# EAGLE design Balancing V3 (EAGLE 9.6.2)
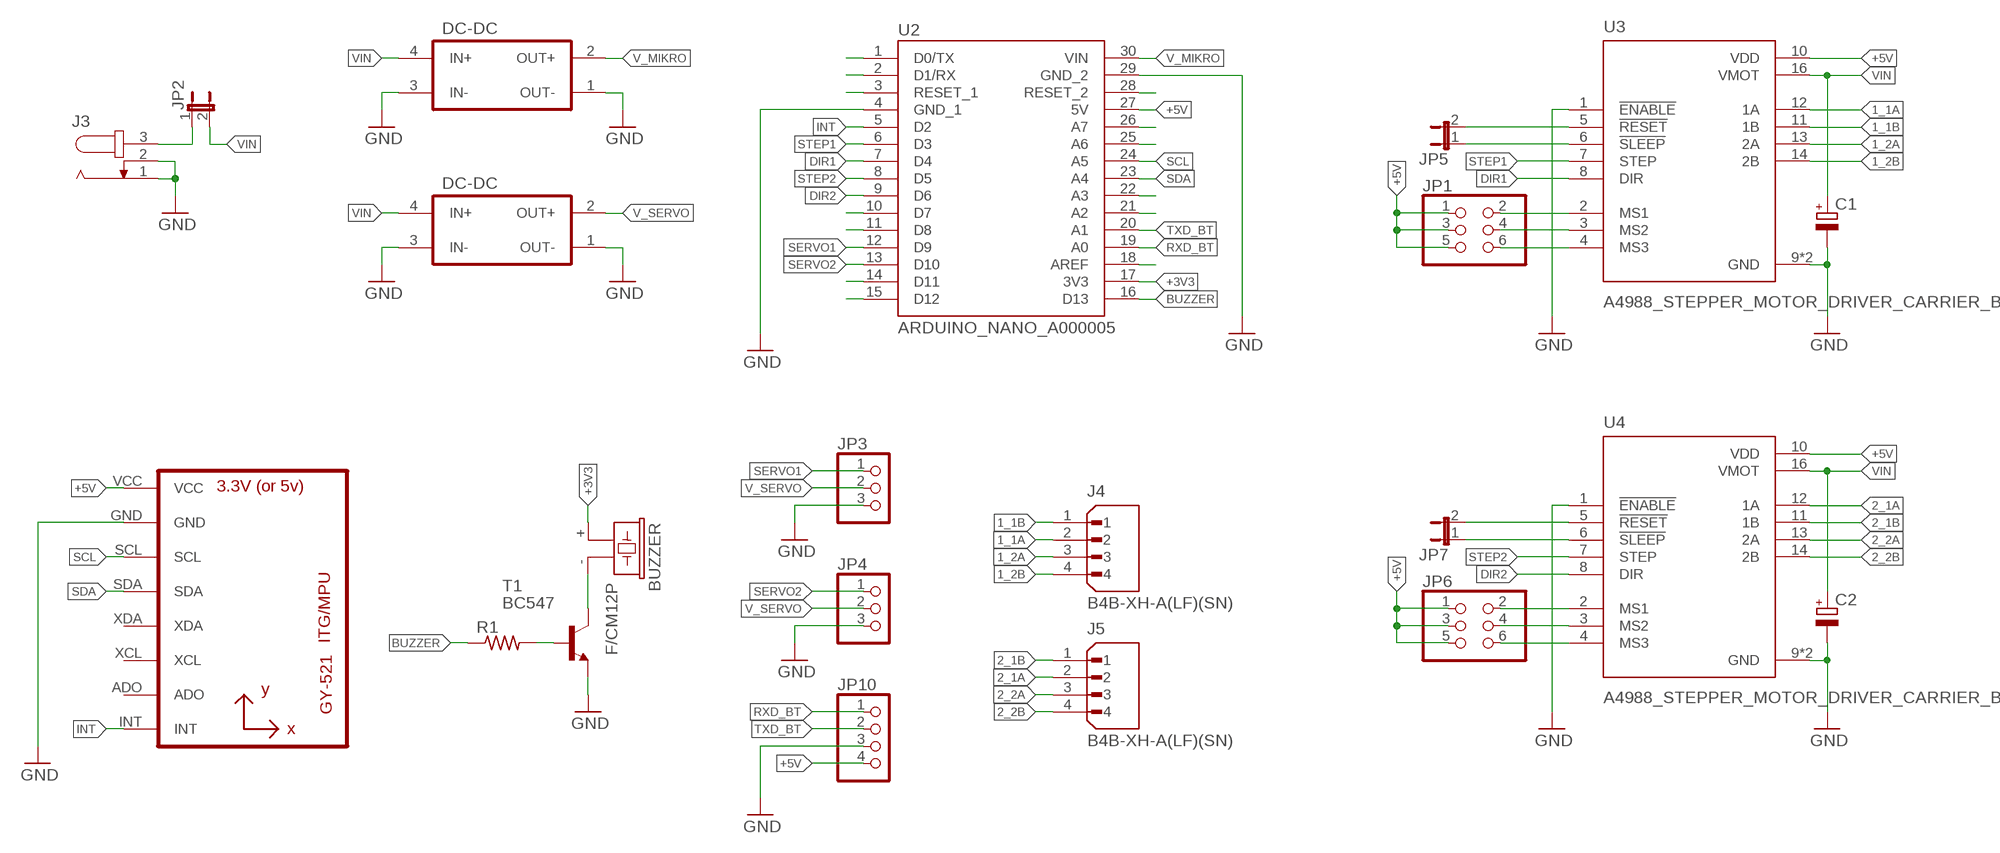
[diagram p0: schematic, sheet 1]

## Parts
BUZZER  F/CM12P  [F/CM12P]
C1  CPOL-EUE2.5-6  [E2,5-6]
C2  CPOL-EUE2.5-6  [E2,5-6]
J3  JACK-PLUG1  [SPC4078]
J4  B4B-XH-A(LF)(SN)  [JST_B4B-XH-A(LF)(SN)]
J5  B4B-XH-A(LF)(SN)  [JST_B4B-XH-A(LF)(SN)]
JP1  PINHD-2X3  [2X03]
JP2  JP1E  [JP1]
JP3  PINHD-1X3  [1X03]
JP4  PINHD-1X3  [1X03]
JP5  JP1E  [JP1]
JP6  PINHD-2X3  [2X03]
JP7  JP1E  [JP1]
JP10  PINHD-1X4  [1X04]
R1  R-US_0204/7  [0204/7]
T1  BC547  [TO92]
U1  GY-521MPU6050  [GY-521]
U2  ARDUINO_NANO_A000005  [MODULE_ARDUINO_NANO_A000005]
U3  A4988_STEPPER_MOTOR_DRIVER_CARRIER_BLACK  [MODULE_A4988_STEPPER_MOTOR_DRIVER_CARRIER_BLACK]
U4  A4988_STEPPER_MOTOR_DRIVER_CARRIER_BLACK  [MODULE_A4988_STEPPER_MOTOR_DRIVER_CARRIER_BLACK]
U$1  DC-DC_CONV  [DC-DC_CONV]
U$2  DC-DC_CONV  [DC-DC_CONV]

## Nets
1_1A: J4.2 U3.12(1A)
1_1B: J4.1 U3.11(1B)
1_2A: J4.3 U3.13(2A)
1_2B: J4.4 U3.14(2B)
2_1A: J5.2 U4.12(1A)
2_1B: J5.1 U4.11(1B)
2_2A: J5.3 U4.13(2A)
2_2B: J5.4 U4.14(2B)
+3V3: BUZZER.+ U2.17(3V3)
+5V: JP1.1 JP1.3 JP1.5 JP6.1 JP6.3 JP6.5 JP10.4 U1.VCC U2.27(5V) U3.10(VDD) U4.10(VDD)
BUZZER: R1.1 U2.16(D13)
DIR1: U2.7(D4) U3.8(DIR)
DIR2: U2.9(D6) U4.8(DIR)
GND: C1.- C2.- J3.1 J3.2 JP3.3 JP4.3 JP10.3 T1.1(E) U1.GND U2.4(GND_1) U2.29(GND_2) U3.1(!ENABLE) U3.9(GND) U3.15(GND) U4.1(!ENABLE) U4.9(GND) U4.15(GND) U$1.1(OUT-) U$1.3(IN-) U$2.1(OUT-) U$2.3(IN-)
INT: U1.INT U2.5(D2)
N$1: R1.2 T1.2(B)
N$2: BUZZER.- T1.3(C)
N$11: U2.28(RESET_2)
N$13: U2.26(A7)
N$14: U2.25(A6)
N$17: U2.22(A3)
N$18: U2.21(A2)
N$21: U2.18(AREF)
N$24: U2.1(D0/TX)
N$25: U2.2(D1/RX)
N$26: U2.3(RESET_1)
N$33: U2.10(D7)
N$34: U2.11(D8)
N$37: U2.14(D11)
N$38: U2.15(D12)
N$39: JP1.2 U3.2(MS1)
N$40: J3.3 JP2.1
N$41: JP1.4 U3.3(MS2)
N$42: JP1.6 U3.4(MS3)
N$43: JP7.2 U4.5(!RESET)
N$44: JP7.1 U4.6(!SLEEP)
N$45: JP6.2 U4.2(MS1)
N$46: JP6.4 U4.3(MS2)
N$47: JP6.6 U4.4(MS3)
N$60: JP5.2 U3.5(!RESET)
N$61: JP5.1 U3.6(!SLEEP)
RXD_BT: JP10.1 U2.19(A0)
SCL: U1.SCL U2.24(A5)
SDA: U1.SDA U2.23(A4)
SERVO1: JP3.1 U2.12(D9)
SERVO2: JP4.1 U2.13(D10)
STEP1: U2.6(D3) U3.7(STEP)
STEP2: U2.8(D5) U4.7(STEP)
TXD_BT: JP10.2 U2.20(A1)
V_MIKRO: U2.30(VIN) U$1.2(OUT+)
V_SERVO: JP3.2 JP4.2 U$2.2(OUT+)
VIN: C1.+ C2.+ JP2.2 U3.16(VMOT) U4.16(VMOT) U$1.4(IN+) U$2.4(IN+)
Unconnected: U1.ADO U1.XCL U1.XDA

## Library data of the parts
BUZZER = buzzer:F/CM12P: BUZZER Source: Buerklin; OC_FARNELL: unknown; OC_NEWARK: unknown
C1 C2 = rcl:CPOL-EU: POLARIZED CAPACITOR, European symbol; SPICEPREFIX: C
J3 = con-jack:JACK-PLUG: DC POWER JACK Power Jack, DC, Right Angle, Through Hole, Rated 5A at 16VDC, PC Terminals Distributor: Farnell (www.Farnell.de) Drawing: 84N1161.pdf / 84N1162.pdf Manufacturer: SPC Technology (www.spctechnology.com) Type: SPC4077 / SPC 4078; OC_FARNELL: unknown; OC_NEWARK: unknown
J4 J5 = JST_4P:B4B-XH-A(LF)(SN): Check availability <https://pricing.snapeda.com/parts/B4B-XH-A%20%20%28LF%29%28SN%29/JST/view-part?ref=eda>; AVAILABILITY: In Stock; CHECK_PRICES: https://www.snapeda.com/parts/B4B-XH-A%20%20(LF)(SN)/JST/view-part/?ref=eda; DESCRIPTION: HEADER, VERTICAL, 4WAY; Pitch Spacing: 2.5mm; No. of Contacts: 4Contacts; Gender: Header; Product Range: XH Series; Contact Termination Type: Through Hole; No. of Rows: 1Rows; Contact Plating: Tin Plated Contacts; Contact Material: Brass; SVHC: No SVHC (17-Dec-2015); Contact Resistance: 10mohm; Current Rating: 3A; Insulation Resistance: 1000Mohm; Operating Temperature Max: 85°C; Operating Temperature Min: -25°C; Voltage Rating VAC: 250V; Wire Size AWG Max: 22AWG; Wire Size AWG Min: 30AWG; Withstand Voltage: 1000V; MF: JST; MP: B4B-XH-A (LF)(SN); PACKAGE: None; PRICE: None; SNAPEDA_LINK: https://www.snapeda.com/parts/B4B-XH-A%20%20(LF)(SN)/JST/view-part/?ref=snap
JP1 JP6 = pinhead:PINHD-2X3: PIN HEADER
JP2 JP5 JP7 = jumper:JP1E: JUMPER
JP3 JP4 = pinhead:PINHD-1X3: PIN HEADER
JP10 = pinhead:PINHD-1X4: PIN HEADER
R1 = rcl:R-US_: RESISTOR, American symbol; SPICEPREFIX: R
T1 = transistor:BC547: NPN TRANSISTOR
U1 = gy-521:GY-521
U2 = ARDUINO_NANO_A000005:ARDUINO_NANO_A000005: Check availability <https://pricing.snapeda.com/parts/ARDUINO%20NANO%20A000005/Arduino/view-part?ref=eda>; AVAILABILITY: Not in stock; CHECK_PRICES: https://www.snapeda.com/parts/ARDUINO%20NANO%20A000005/Arduino/view-part/?ref=eda; DESCRIPTION: ATSAMD21G18A Arduino Nano 33 IoT series ARM® Cortex®-M0+ MCU 32-Bit Embedded Evaluation Board; MF: Arduino; MP: ARDUINO NANO A000005; PACKAGE: Non-Standard Arduino; PRICE: None; SNAPEDA_LINK: https://www.snapeda.com/parts/ARDUINO%20NANO%20A000005/Arduino/view-part/?ref=snap
U3 U4 = A4988_STEPPER_MOTOR_DRIVER_CARRIER_BLACK:A4988_STEPPER_MOTOR_DRIVER_CARRIER_BLACK: Stepper motor controler; IC: A4988; 1A; Uin mot: 8÷35V Check availability <https://pricing.snapeda.com/parts/A4988%20STEPPER%20MOTOR%20DRIVER%20CARRIER%20BLACK/Pololu/view-part?ref=eda>; AVAILABILITY: Not in stock; CHECK_PRICES: https://www.snapeda.com/parts/A4988%20STEPPER%20MOTOR%20DRIVER%20CARRIER%20BLACK/Pololu/view-part/?ref=eda; DESCRIPTION: Stepper motor controler; IC: A4988; 1.2A; Uin mot: 8÷35V; MF: Pololu; MP: A4988 STEPPER MOTOR DRIVER CARRIER BLACK; PACKAGE: None; PRICE: None; SNAPEDA_LINK: https://www.snapeda.com/parts/A4988%20STEPPER%20MOTOR%20DRIVER%20CARRIER%20BLACK/Pololu/view-part/?ref=snap
U$1 U$2 = devkrzyzanowskiLib:DC-DC_CONV

## Board
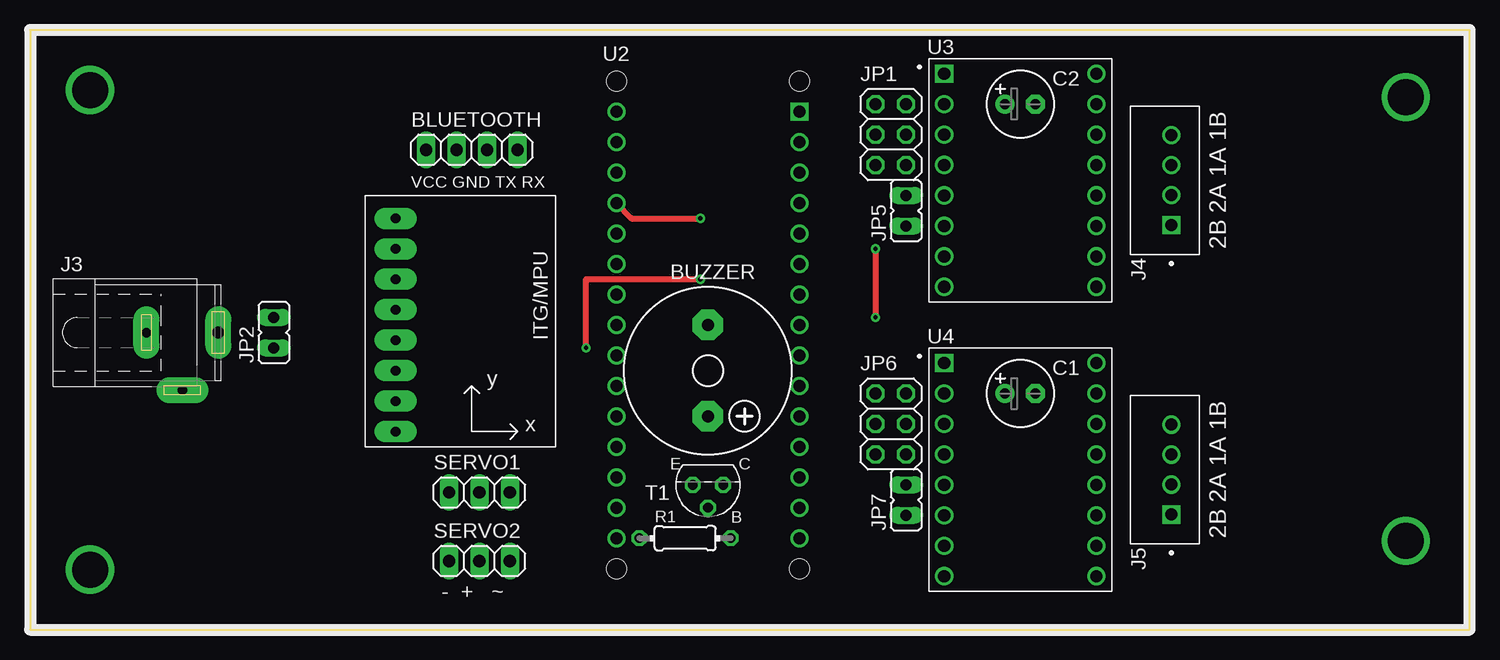
[diagram p1: board, top side]
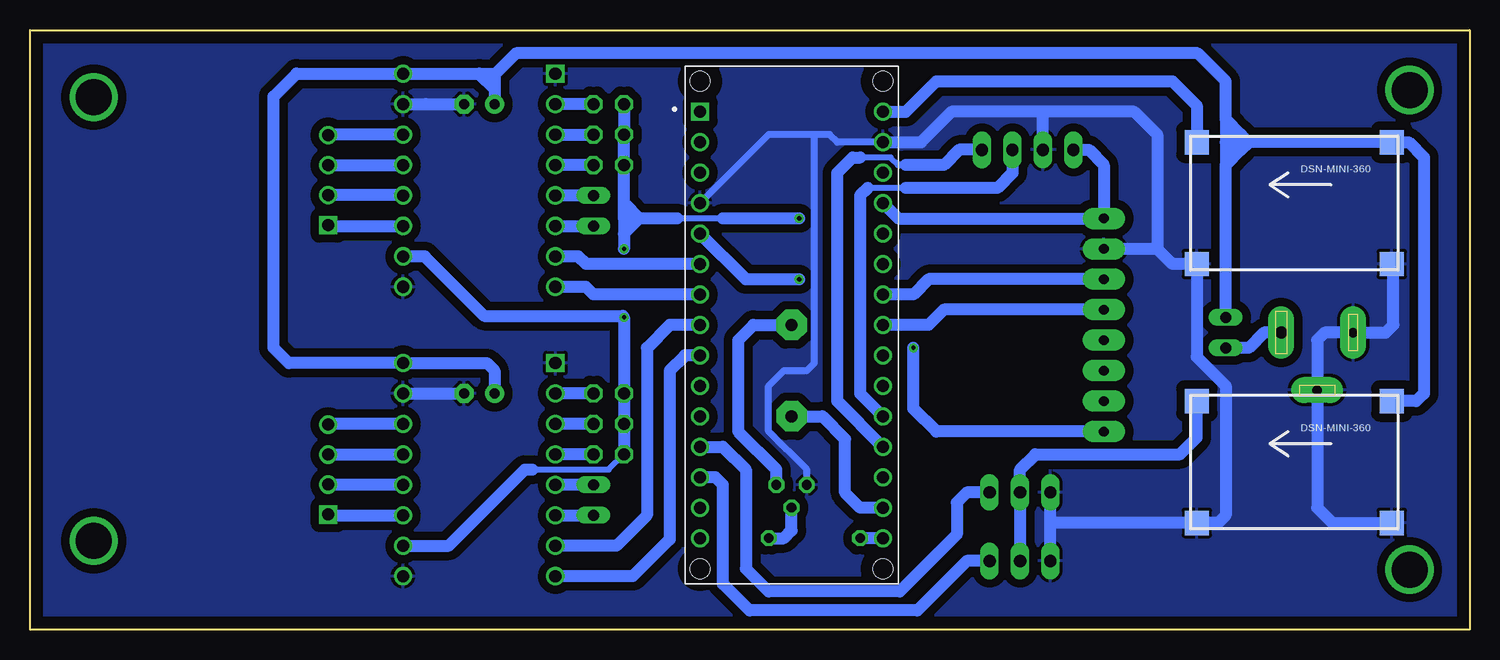
[diagram p2: board, bottom side, seen from below]

Size 120 x 50 mm. Coordinates in mm from the lower left corner, seen from the top.
Outline: 0,0 120,0 120,50 0,50 0,0
Copper layers (1*16): Top 0.035mm / dielectric 1.5mm / Bottom 0.035mm
Design rules "default": minimum track width 6mil, minimum drill 0.35mm, track to track 6mil, track to pad 6mil, pad to pad 6mil, via to via 6mil, smd to smd 6mil, copper to edge 40mil, drill to drill 6mil, minimum pad ring 10mil, minimum via ring 8mil, stop-mask expansion 4mil, vias tented up to drill 0mil, thermal gap 10mil

### Footprints (pad centres in the part's own frame; a part is rotated, then mirrored left to right if it is on the bottom)
F/CM12P = drill 1.016 pad 2.54 octagon: + 3.81,0; - -3.81,0
E2,5-6 = drill 0.813 pad 1.6: + -1.27,0 | drill 0.813 pad 1.6 octagon: - 1.27,0
SPC4078 = drill 0.8 pad 2.184 long: 1 -3,0; 2 0,-4.8 | drill 1 pad 2.184 long: 3 3,0
JST_B4B-XH-A(LF)(SN) = drill 1 square: 1 -3.75,-0.525 | drill 1: 2 -1.25,-0.525; 3 1.25,-0.525; 4 3.75,-0.525
2X03 = drill 1.016 octagon: 1 -2.54,-1.27; 2 -2.54,1.27; 3 0,-1.27; 4 0,1.27; 5 2.54,-1.27; 6 2.54,1.27
JP1 = drill 0.914 long: 1 0,-1.27; 2 0,1.27
1X03 = drill 1.016 long: 1 -2.54,0; 2 0,0; 3 2.54,0
1X04 = drill 1.016 long: 1 -3.81,0; 2 -1.27,0; 3 1.27,0; 4 3.81,0
0204/7 = drill 0.813 octagon: 1 -3.81,0; 2 3.81,0
TO92 = drill 0.813 octagon: 1 1.27,0; 2 0,1.905; 3 -1.27,0
GY-521 = drill 0.8 pad 1.778 long: ADO -8.89,-6.35; GND -8.89,6.35; INT -8.89,-8.89; SCL -8.89,3.81; SDA -8.89,1.27; VCC -8.89,8.89; XCL -8.89,-3.81; XDA -8.89,-1.27
MODULE_ARDUINO_NANO_A000005 = drill 1 square: 1 -7.62,17.78 | drill 1: 2 -7.62,15.24; 3 -7.62,12.7; 4 -7.62,10.16; 5 -7.62,7.62; 6 -7.62,5.08; 7 -7.62,2.54; 8 -7.62,0; 9 -7.62,-2.54; 10 -7.62,-5.08; 11 -7.62,-7.62; 12 -7.62,-10.16; 13 -7.62,-12.7; 14 -7.62,-15.24; 15 -7.62,-17.78; 16 7.62,-17.78; 17 7.62,-15.24; 18 7.62,-12.7; 19 7.62,-10.16; 20 7.62,-7.62; 21 7.62,-5.08; 22 7.62,-2.54; 23 7.62,0; 24 7.62,2.54; 25 7.62,5.08; 26 7.62,7.62; 27 7.62,10.16; 28 7.62,12.7; 29 7.62,15.24; 30 7.62,17.78 | hole 1.651: -7.62,-20.32; 7.62,-20.32; -7.62,20.32; 7.62,20.32
MODULE_A4988_STEPPER_MOTOR_DRIVER_CARRIER_BLACK = drill 1.02 square: 1 -6.35,8.89 | drill 1.02: 2 -6.35,6.35; 3 -6.35,3.81; 4 -6.35,1.27; 5 -6.35,-1.27; 6 -6.35,-3.81; 7 -6.35,-6.35; 8 -6.35,-8.89; 9 6.35,-8.89; 10 6.35,-6.35; 11 6.35,-3.81; 12 6.35,-1.27; 13 6.35,1.27; 14 6.35,3.81; 15 6.35,6.35; 16 6.35,8.89
DC-DC_CONV = smd 2.032 x 2.032: 1 -5.08,8.128; 2 5.08,8.128; 3 -5.08,-8.128; 4 5.08,-8.128

### Placement (x,y rotation side)
BUZZER  56.52,21.59 270 top
C1  82.55,19.68 0 top
C2  82.55,43.81 0 top
J3  12.7,24.77 0 top
J4  94.61,37.47 90 top
J5  94.61,13.34 90 top
JP1  71.75,41.27 270 top
JP2  20.32,24.77 0 top
JP3  37.47,11.43 180 top
JP4  37.47,5.71 180 top
JP5  73.03,34.92 0 top
JP6  71.75,17.14 270 top
JP7  73.03,10.79 0 top
JP10  36.83,40.01 180 top
R1  54.61,7.62 0 top
T1  56.52,12.06 180 top
U1  39.37,25.4 0 top
U2  56.52,25.4 0 bottom
U3  82.55,37.47 0 top
U4  82.55,13.34 0 top
U$1  14.61,35.56 90 bottom
U$2  14.61,13.97 90 bottom

### Tracks (layer width: path | path; a pad name or v marks a point on that pad's centre or on a via)
1_1A
  Bottom 1: U3.12 88.92,36.22 J4.2
1_1B
  Bottom 1: J4.1 95.08,33.66 U3.11
1_2A
  Bottom 1: J4.3 88.92,38.72 U3.13
1_2B
  Bottom 1: U3.14 95.08,41.27 J4.4
2_1A
  Bottom 1: U4.12 95.12,12.06 J5.2
2_1B
  Bottom 1: J5.1 95.08,9.53 U4.11
2_2A
  Bottom 1: J5.3 88.92,14.59 U4.13
2_2B
  Bottom 1: U4.14 95.08,17.14 J5.4
+3V3
  Bottom 1: U2.17 50.8,10.16 52.05,11.41 52.05,15.88 53.96,17.78 BUZZER.+
+5V  (via drill 0.35)
  Top 0.5: U2.27 50.16,34.29 v55.88,34.29 | v70.48,31.75 v70.48,26.04
  Bottom 0.5: 78.11,13.34 71.75,13.34 JP6.5 | 70.48,34.29 69.22,34.29 | 62.23,34.29 66.04,34.29
  Bottom 1: JP10.4 31.75,40.01 30.48,38.73 U1.VCC 47.62,34.29 U2.27 | JP1.1 JP1.3 JP1.5 70.48,35.56 | JP6.5 JP6.3 JP6.1 v70.48,26.04 70.6,26.15 82.13,26.15 87.09,31.11 U3.10 | U4.10 85.09,6.99 78.74,13.34 78.11,13.34 | 70.48,35.56 70.48,34.29 70.48,33.02 | 70.48,33.02 v70.48,31.75 | 70.48,35.56 69.22,34.29 | 66.04,34.29 69.22,34.29 | 69.22,34.29 70.48,33.02 | v55.88,34.29 62.23,34.29
BUZZER
  Bottom 1: U2.16 R1.1
DIR1
  Bottom 1: U2.7 73.03,27.94 73.66,28.57 U3.8
DIR2
  Bottom 1: U2.9 65.41,22.86 66.67,21.59 66.67,7.52 69.75,4.45 U4.8
GND
  Bottom 0.6: U2.29 52.7,40.64 53.34,41.27 54.61,41.27 | 54.61,41.27 58.42,41.27 U2.4 | T1.1 55.24,13.34 58.42,16.51 58.42,20.32 57.15,21.59 55.24,21.59 54.61,22.23 54.61,41.27
  Bottom 1: U$1.3 6.35,30.35 6.35,25.4 6.99,24.77 J3.1 12.06,24.77 12.7,24.13 J3.2 12.7,10.16 11.43,8.89 U$2.3 | U2.29 45.72,40.64 43.18,43.18 35.56,43.18 | 26.04,31.75 26.04,41.27 27.94,43.18 35.56,43.18 | 26.04,31.75 24.77,30.48 U$1.1 22.73,22.73 20.32,20.32 20.32,9.53 20.95,8.89 U$2.1 34.92,8.89 | 26.04,31.75 U1.GND | JP4.3 34.92,8.89 | 34.92,8.89 JP3.3 | JP10.3 35.56,43.18 | U4.15 C1.- | U3.15 87,43.81 C2.-
  pour Bottom (isolate 0.7): 0,0 120,0 120,50 0,50
INT  (via drill 0.35)
  Top 0.5: v46.35,23.5 46.35,29.21 v55.88,29.21
  Bottom 1: U1.INT 44.45,16.51 46.35,18.41 v46.35,23.5 | U2.5 60.33,29.21 v55.88,29.21
N$1
  Bottom 1: R1.2 57.15,7.62 56.52,8.26 T1.2
N$2
  Bottom 1: T1.3 57.78,13.34 60.98,16.53 60.98,24.11 59.69,25.4 BUZZER.-
N$3  (via drill 3)
  other vias: 5,45
N$4  (via drill 3)
  other vias: 5,5
N$5  (via drill 3)
  other vias: 114.7,44.4
N$6  (via drill 3)
  other vias: 114.7,7.4
N$39
  Bottom 1: JP1.2 U3.2
N$40
  Bottom 1: J3.3 17.14,24.77 18.41,23.5 JP2.1
N$41
  Bottom 1: U3.3 JP1.4
N$42
  Bottom 1: JP1.6 U3.4
N$43
  Bottom 1: JP7.2 U4.5
N$44
  Bottom 1: U4.6 JP7.1
N$45
  Bottom 1: JP6.2 U4.2
N$46
  Bottom 1: JP6.4 U4.3
N$47
  Bottom 1: JP6.6 U4.4
N$60
  Bottom 1: JP5.2 U3.5
N$61
  Bottom 1: U3.6 JP5.1
RXD_BT
  Bottom 0.5: 47.62,38.73 48.26,39.37 50.8,39.37
  Bottom 0.6: 46.99,38.73 47.62,38.73
  Bottom 1: JP10.1 42.55,40.01 43.81,38.73 46.99,38.73 | U2.19 52.7,19.05 52.7,38.1 51.44,39.37 50.8,39.37
SCL
  Bottom 1: U1.SCL 45.09,29.21 46.35,27.94 U2.24
SDA
  Bottom 1: U1.SDA 43.81,26.67 45.09,25.4 U2.23
SERVO1
  Bottom 1: U2.12 62.23,15.24 60.33,13.34 60.33,5.08 58.42,3.17 47.49,3.17 42.74,7.92 42.74,10.6 41.91,11.43 JP3.1
SERVO2
  Bottom 1: JP4.1 41.91,5.71 46.03,1.59 60.01,1.59 62.23,3.81 62.23,12.06 62.87,12.7 U2.13
STEP1
  Bottom 1: U2.6 73.66,30.48 74.3,31.11 U3.7
STEP2
  Bottom 1: U2.8 66.67,25.4 68.58,23.5 68.58,9.53 71.12,6.99 U4.7
TXD_BT
  Bottom 0.5: 46.99,36.83 50.16,36.83
  Bottom 1: JP10.2 38.1,38.1 39.37,36.83 46.99,36.83 | U2.20 50.8,19.68 50.8,36.2 50.16,36.83
V_MIKRO
  Bottom 1: U2.30 46.99,43.18 44.45,45.72 24.77,45.72 22.73,43.69 U$1.2
V_SERVO
  Bottom 1: JP4.2 JP3.2 37.47,13.34 36.2,14.61 24.13,14.61 22.73,16 U$2.2
VIN
  Bottom 1: JP2.2 20.32,38.73 | 20.32,38.73 19.05,40.01 | 19.05,40.01 18.41,40.64 | 18.41,40.64 U$1.4 5.08,40.64 3.81,39.37 3.81,19.68 4.45,19.05 U$2.4 | 82.55,46.35 U3.16 97.79,46.35 99.69,44.45 99.69,23.5 98.42,22.23 U4.16 81.92,22.23 81.28,21.59 C1.+ | 82.55,46.35 81.28,45.09 | 81.28,45.09 C2.+ | 82.55,46.35 81.19,46.35 | 81.19,46.35 79.49,48.06 22.66,48.06 20.32,45.72 20.32,42.55 | 19.05,41.27 20.32,42.55 | 20.32,42.55 20.32,40.64 | 20.32,40.64 20.32,38.73 | 18.41,40.64 19.05,40.64 19.68,41.27 19.05,41.27 | 19.05,41.27 18.73,40.96 | 19.05,40.01 19.68,40.01 20.32,40.64 | 81.19,46.35 81.28,46.27 81.28,45.09

### Text on the board
tNames: BLUETOOTH | VCC GND TX RX | 2B 2A 1A 1B | SERVO1 | E | C | B | SERVO2 | 2B 2A 1A 1B | - + ~